# EasyEDA Pro project HammerHacks II Badge PCB.eprj

# Schematic HammerHacks II Badge PCB
Board Name: HammerHacks II Badge PCB; Create Date: 2026-04-06; Page Name: HammerHacks II Badge PCB; Project Name: HammerHacks II Badge PCB; Schematic Name: HammerHacks II Badge PCB; Update Date: 2026-04-06; File: HammerHacks II Badge PCB; Id: /; Sheet: /
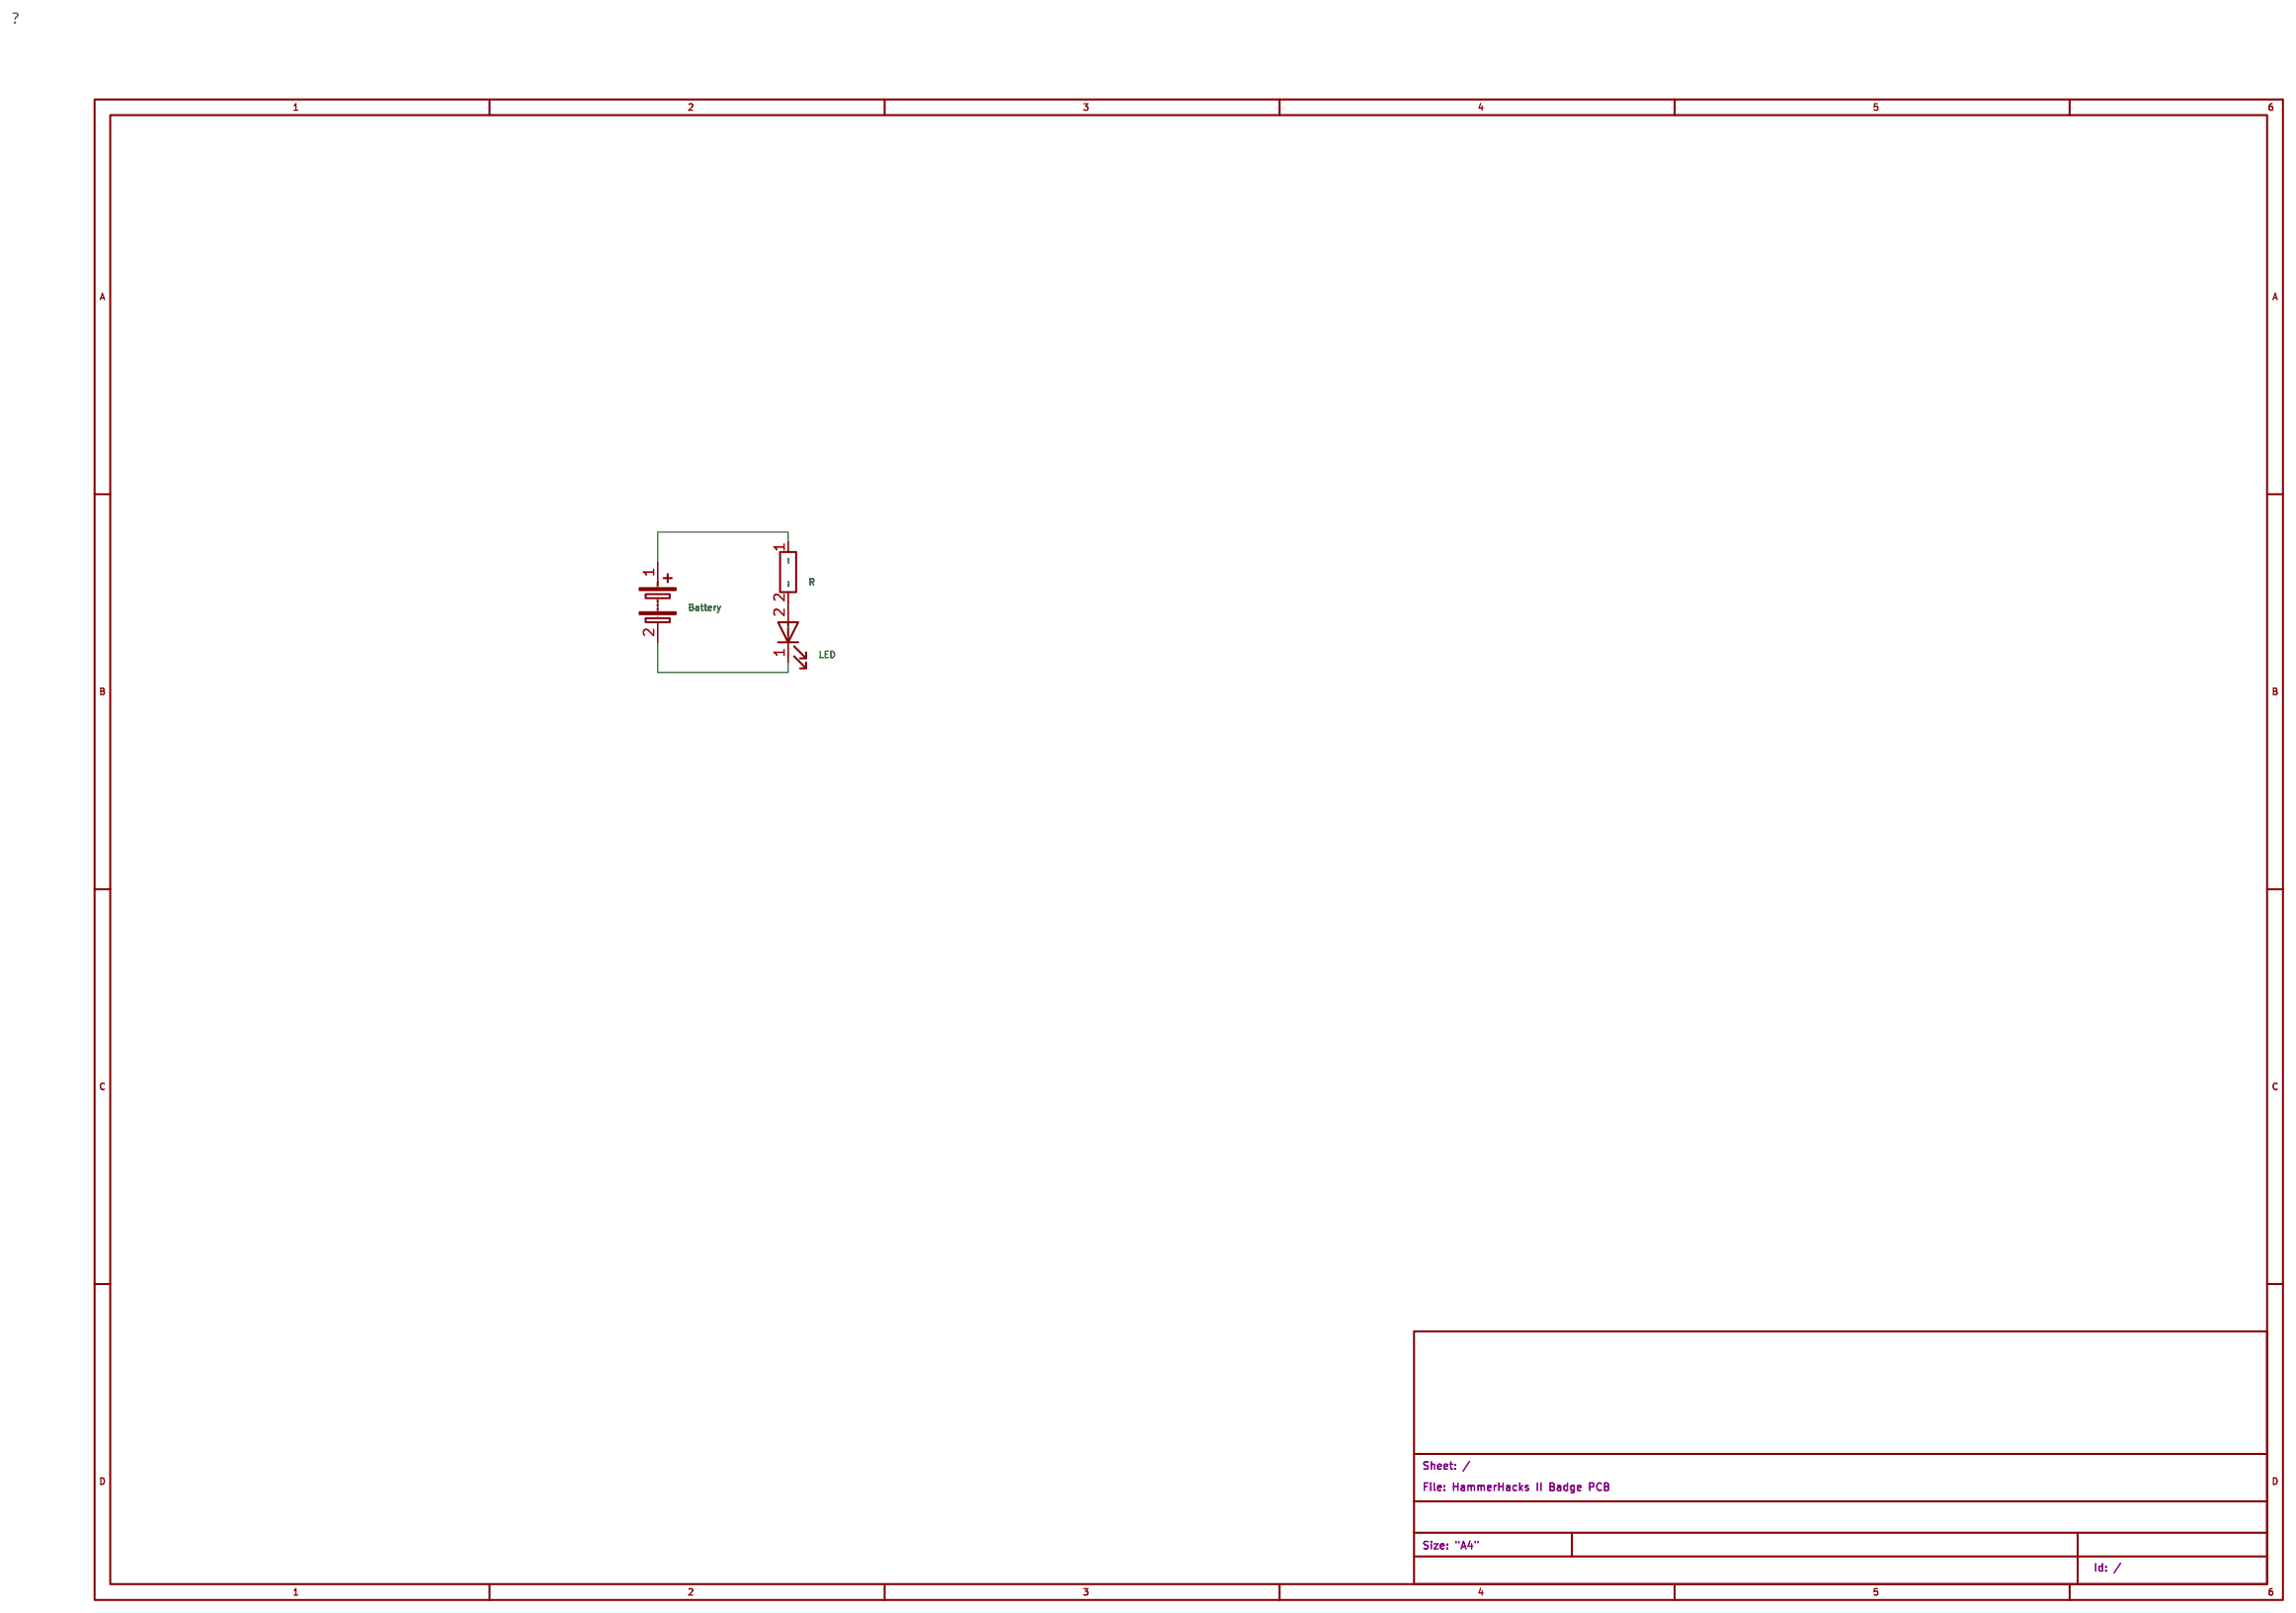
[diagram p0: schematic sheet]

## Parts
BT1  Battery  [Battery:BatteryHolder_Keystone_3034_1x20mm]
D1  LED  [LED_THT:LED_D3.0mm]
R1  R  [RES-TH_BD2.3-L6.3-P10.3-D0.6]

## Library data of the parts
BT1 = Device_Battery: Multiple-cell battery
D1 = Device_LED: Light emitting diode; Sim_Pins: 1=K 2=A; Sim.Pins: 1=K 2=A
R1 = Device_R: Resistor

## Nets
$1N1: BT1.2(-) D1.1(K)
$1N2: BT1.1(+) R1.1
$1N54: D1.2(A) R1.2

# Board OLD
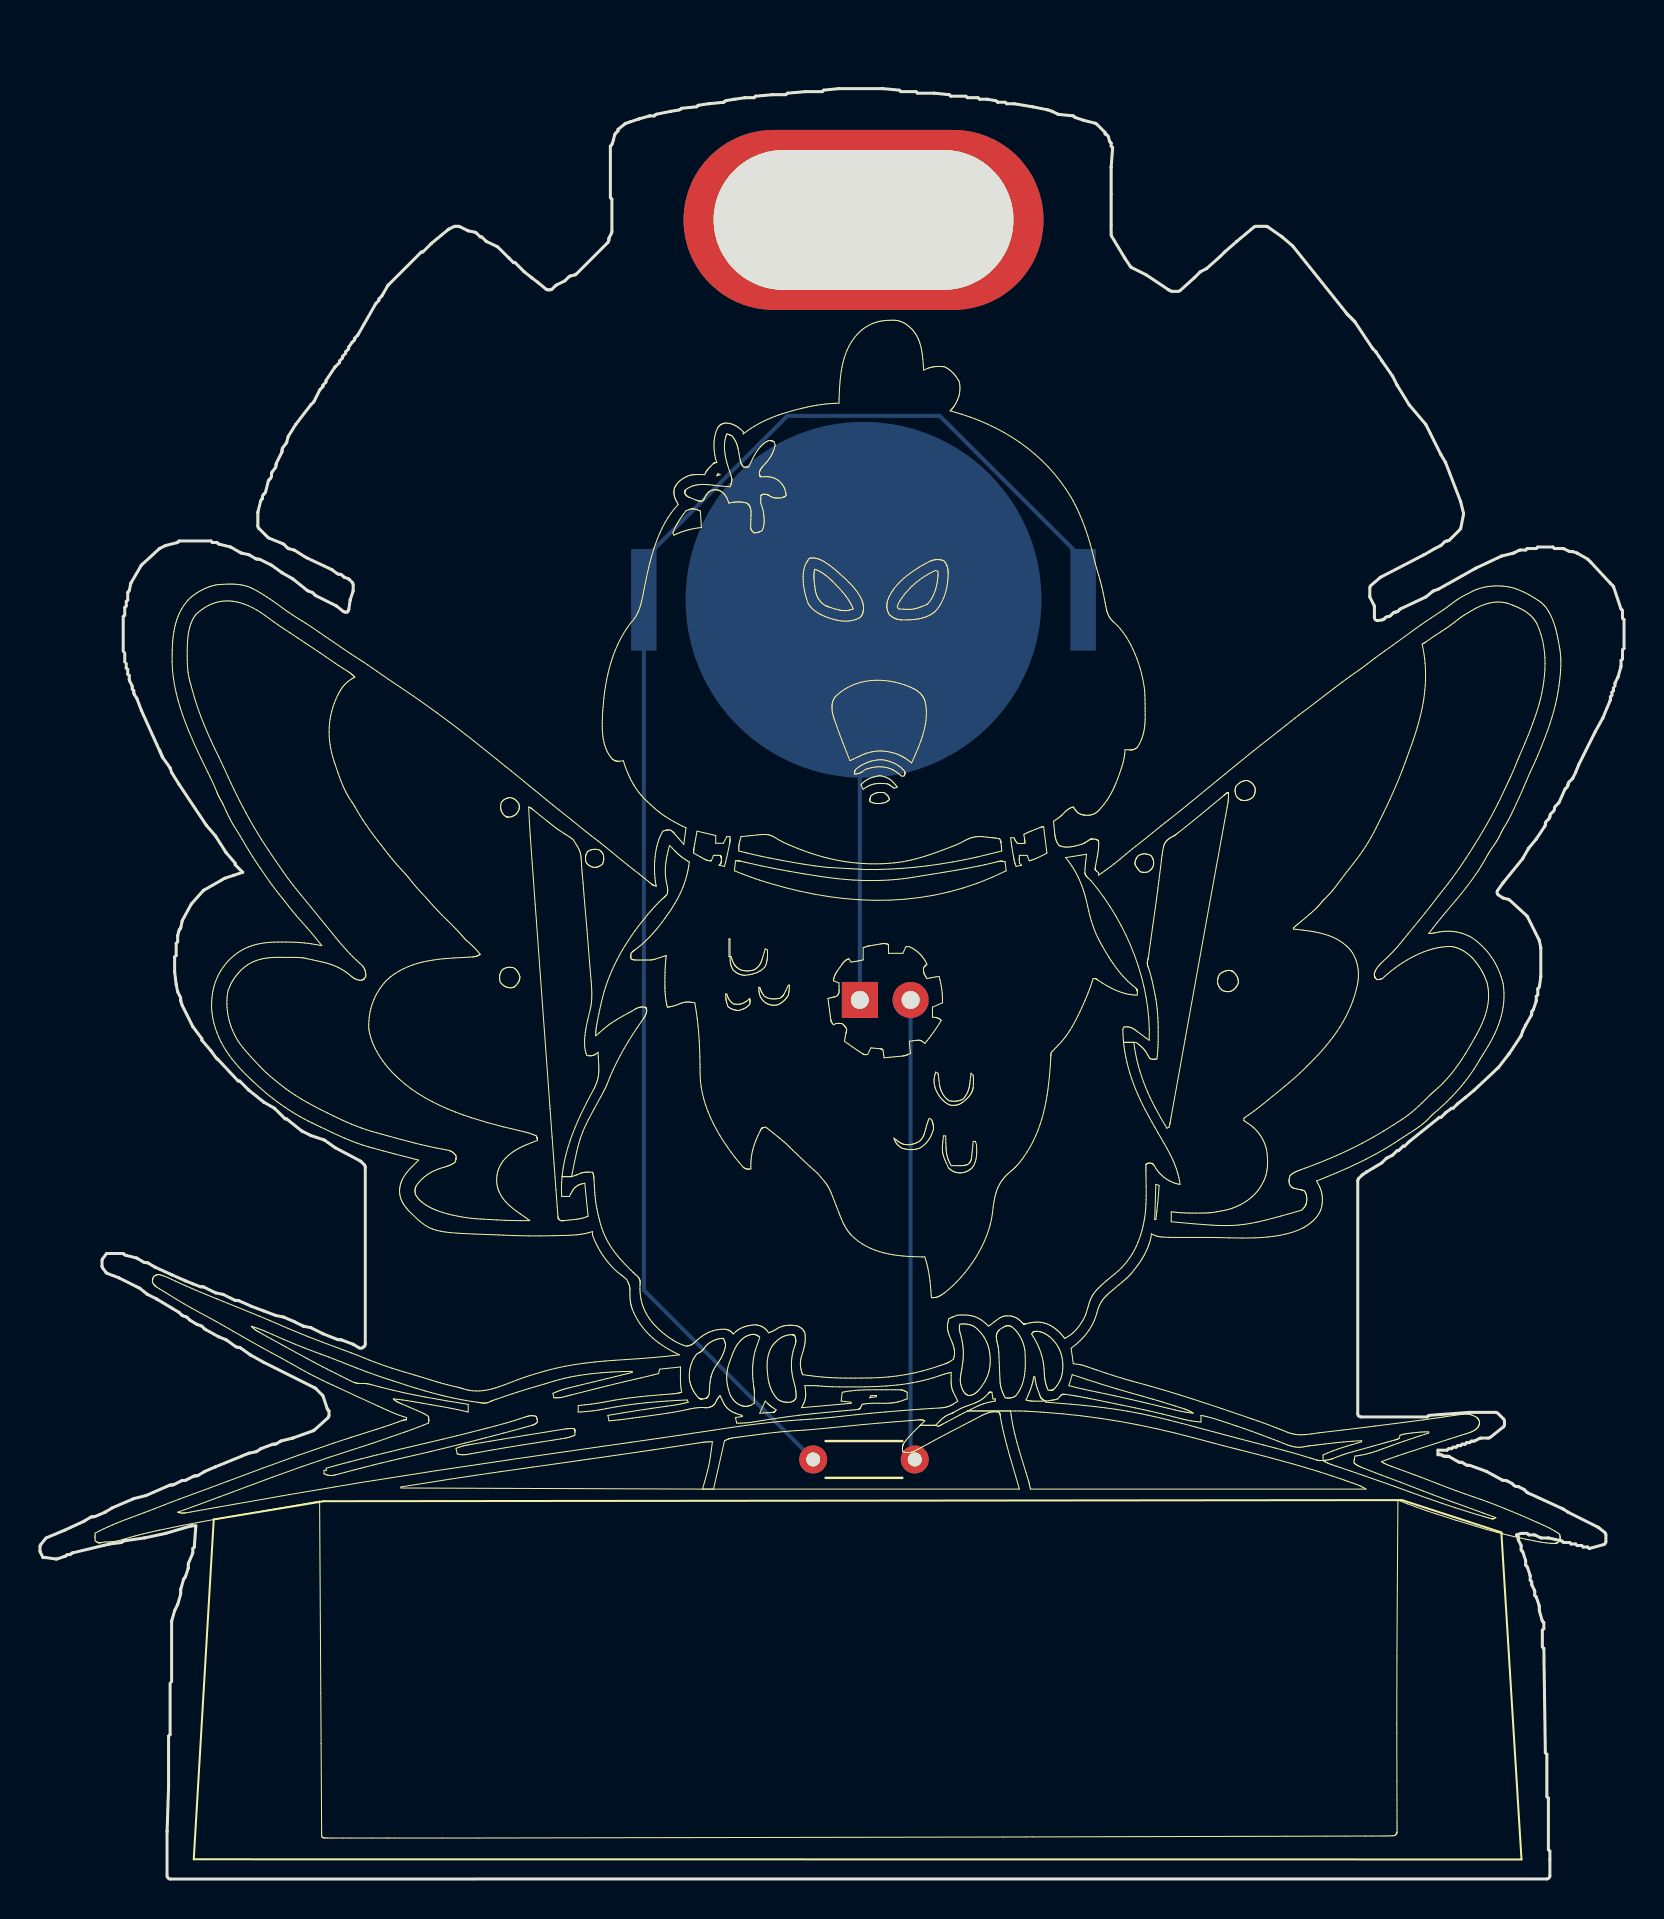
[diagram p1: board, top side]
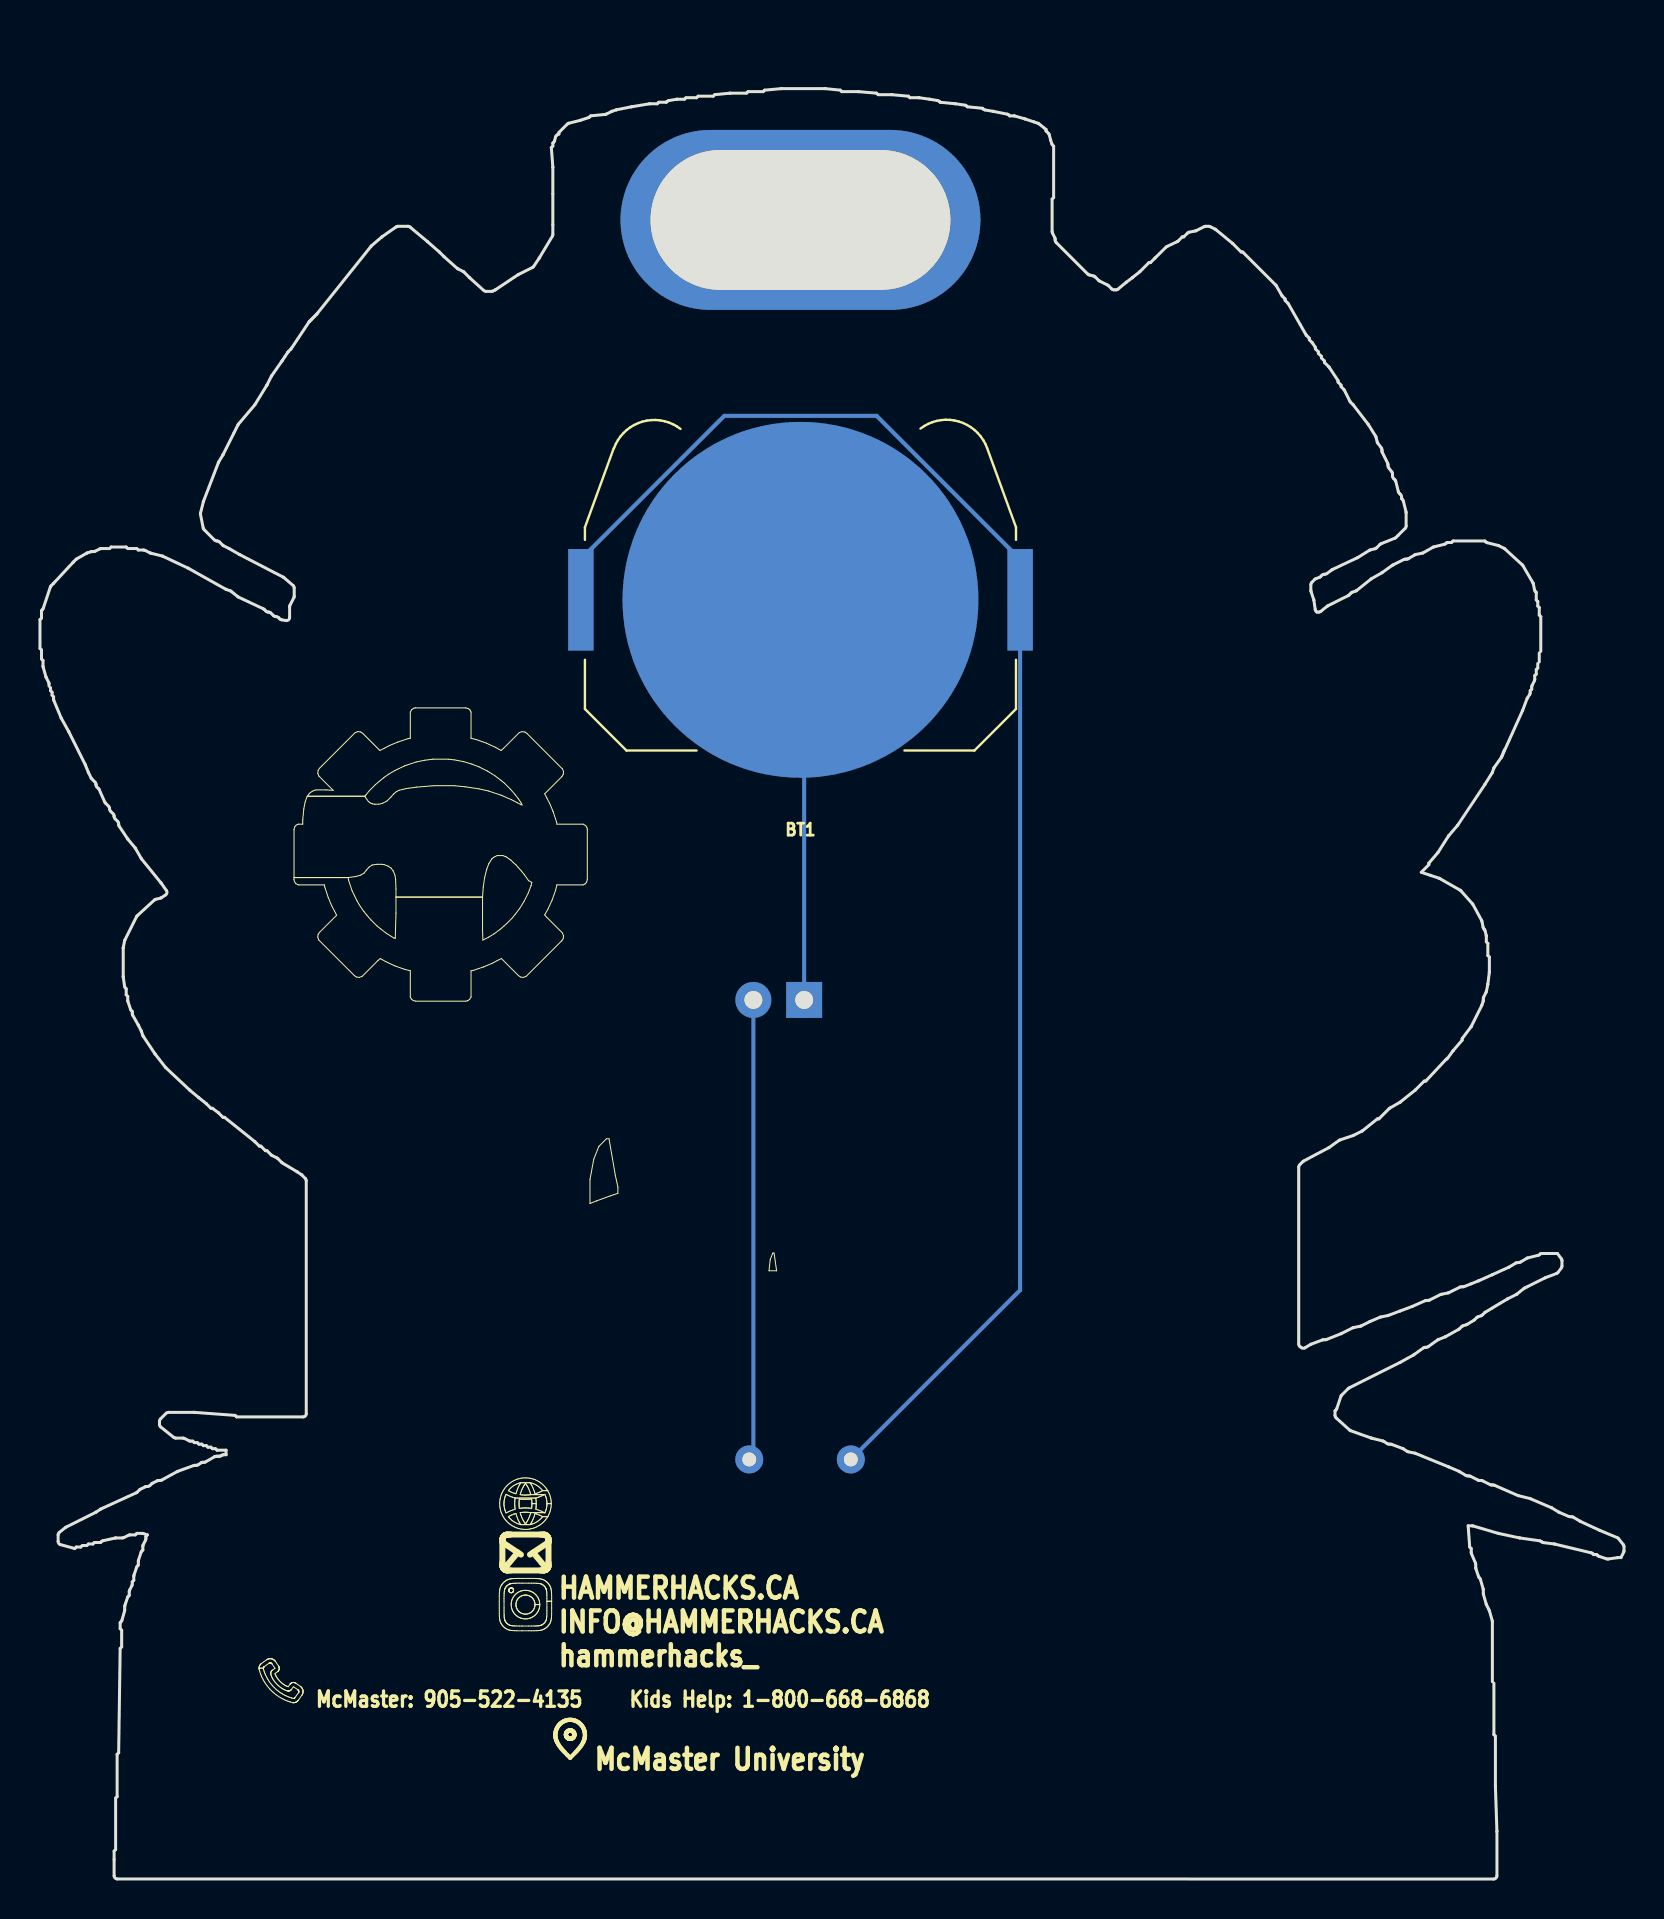
[diagram p2: board, bottom side, seen from below]

Outline 79.23 x 89.55 mm; copper layers: Top Layer, Bottom Layer. Coordinates in mm from the lower left corner of the outline.
Stack: Top Layer 0.035mm / Dielectric1 1.51mm FR4 er 4.5 / Bottom Layer 0.035mm

## Design rules (mm)
spacing safeClearance (default): track to track 0, other pairs 0 to 0.5
track width trackWidth (default): min 0.127, default 0.254, max 2.54
differential pair differentialPair (default): width min 0.127, default 0.254, max 2.54; gap min 0.152, default 0.152
via viaSize (default): diameter min 0.5, default 0.61, max 10; hole min 0.3, default 0.305, max 6

## Placement (name value [footprint] x y rotation side)
BT1  Battery  [Battery:BatteryHolder_Keystone_3034_1x20mm]  41.19 63.98 0 bottom
D1  LED  [LED_THT:LED_D3.0mm]  41.01 43.97 0 top
R1  -  [Resistor_THT:R_Axial_DIN0204_L3.6mm_D1.6mm_P5.08mm_Horizontal]  38.67 20.99 0 top
REF**  Lan Hole  [hole:Lan Hole]  46.19 81.49 0 top

## Footprints (pads in the part's own frame, mm; a bottom-side part is the same pattern mirrored in y, then rotated)
Battery:BatteryHolder_Keystone_3034_1x20mm
  rect 1.27x5.08 smd: 1(-10.985,0) 1(10.985,0)
  round 17.8 smd: 2(0,0)
hole:Lan Hole
  oval 18x9 hole 15x7: (-5,1.5)
LED_THT:LED_D3.0mm
  rect 1.8x1.8 hole 0.9: 1(0,0)
  round 1.8 hole 0.9: 2(2.54,0)
Resistor_THT:R_Axial_DIN0204_L3.6mm_D1.6mm_P5.08mm_Horizontal
  round 1.4 hole 0.7: 1(0,0) 2(5.08,0)

## Nets
NET-(BT1-+): BT1.1 R1.1
NET-(BT1--): BT1.2 D1.1
NET-(D1-A): D1.2 R1.2

## Routing (per net, layer and track width the routed paths; a pad name or vN(x,y) marks a point on that pad's centre or on a via; arc(x,y) is an arc through that point)
NET-(BT1-+): length 78.5
  Bottom Layer w0.2: BT1.1 52.18,66.01 45,73.19 37.38,73.19 30.21,66.01 BT1.1 30.21,29.45 R1.1
NET-(BT1--): length 20.1
  Bottom Layer w0.2: BT1.2 41.01,63.8 D1.1 ; 41.19,43.99 41.22,43.97
NET-(D1-A): length 23.1
  Bottom Layer w0.2: R1.2 43.55,21.19 D1.2 ; 43.75,43.97 43.76,43.97

## Text on the board
Bottom Silkscreen Layer: McMaster: 905-522-4135	Kids Help: 1-800-668-6868 | McMaster University | HAMMERHACKS.CA / INFO@HAMMERHACKS.CA / hammerhacks_

# Board HammerHacks II Badge PCB_1
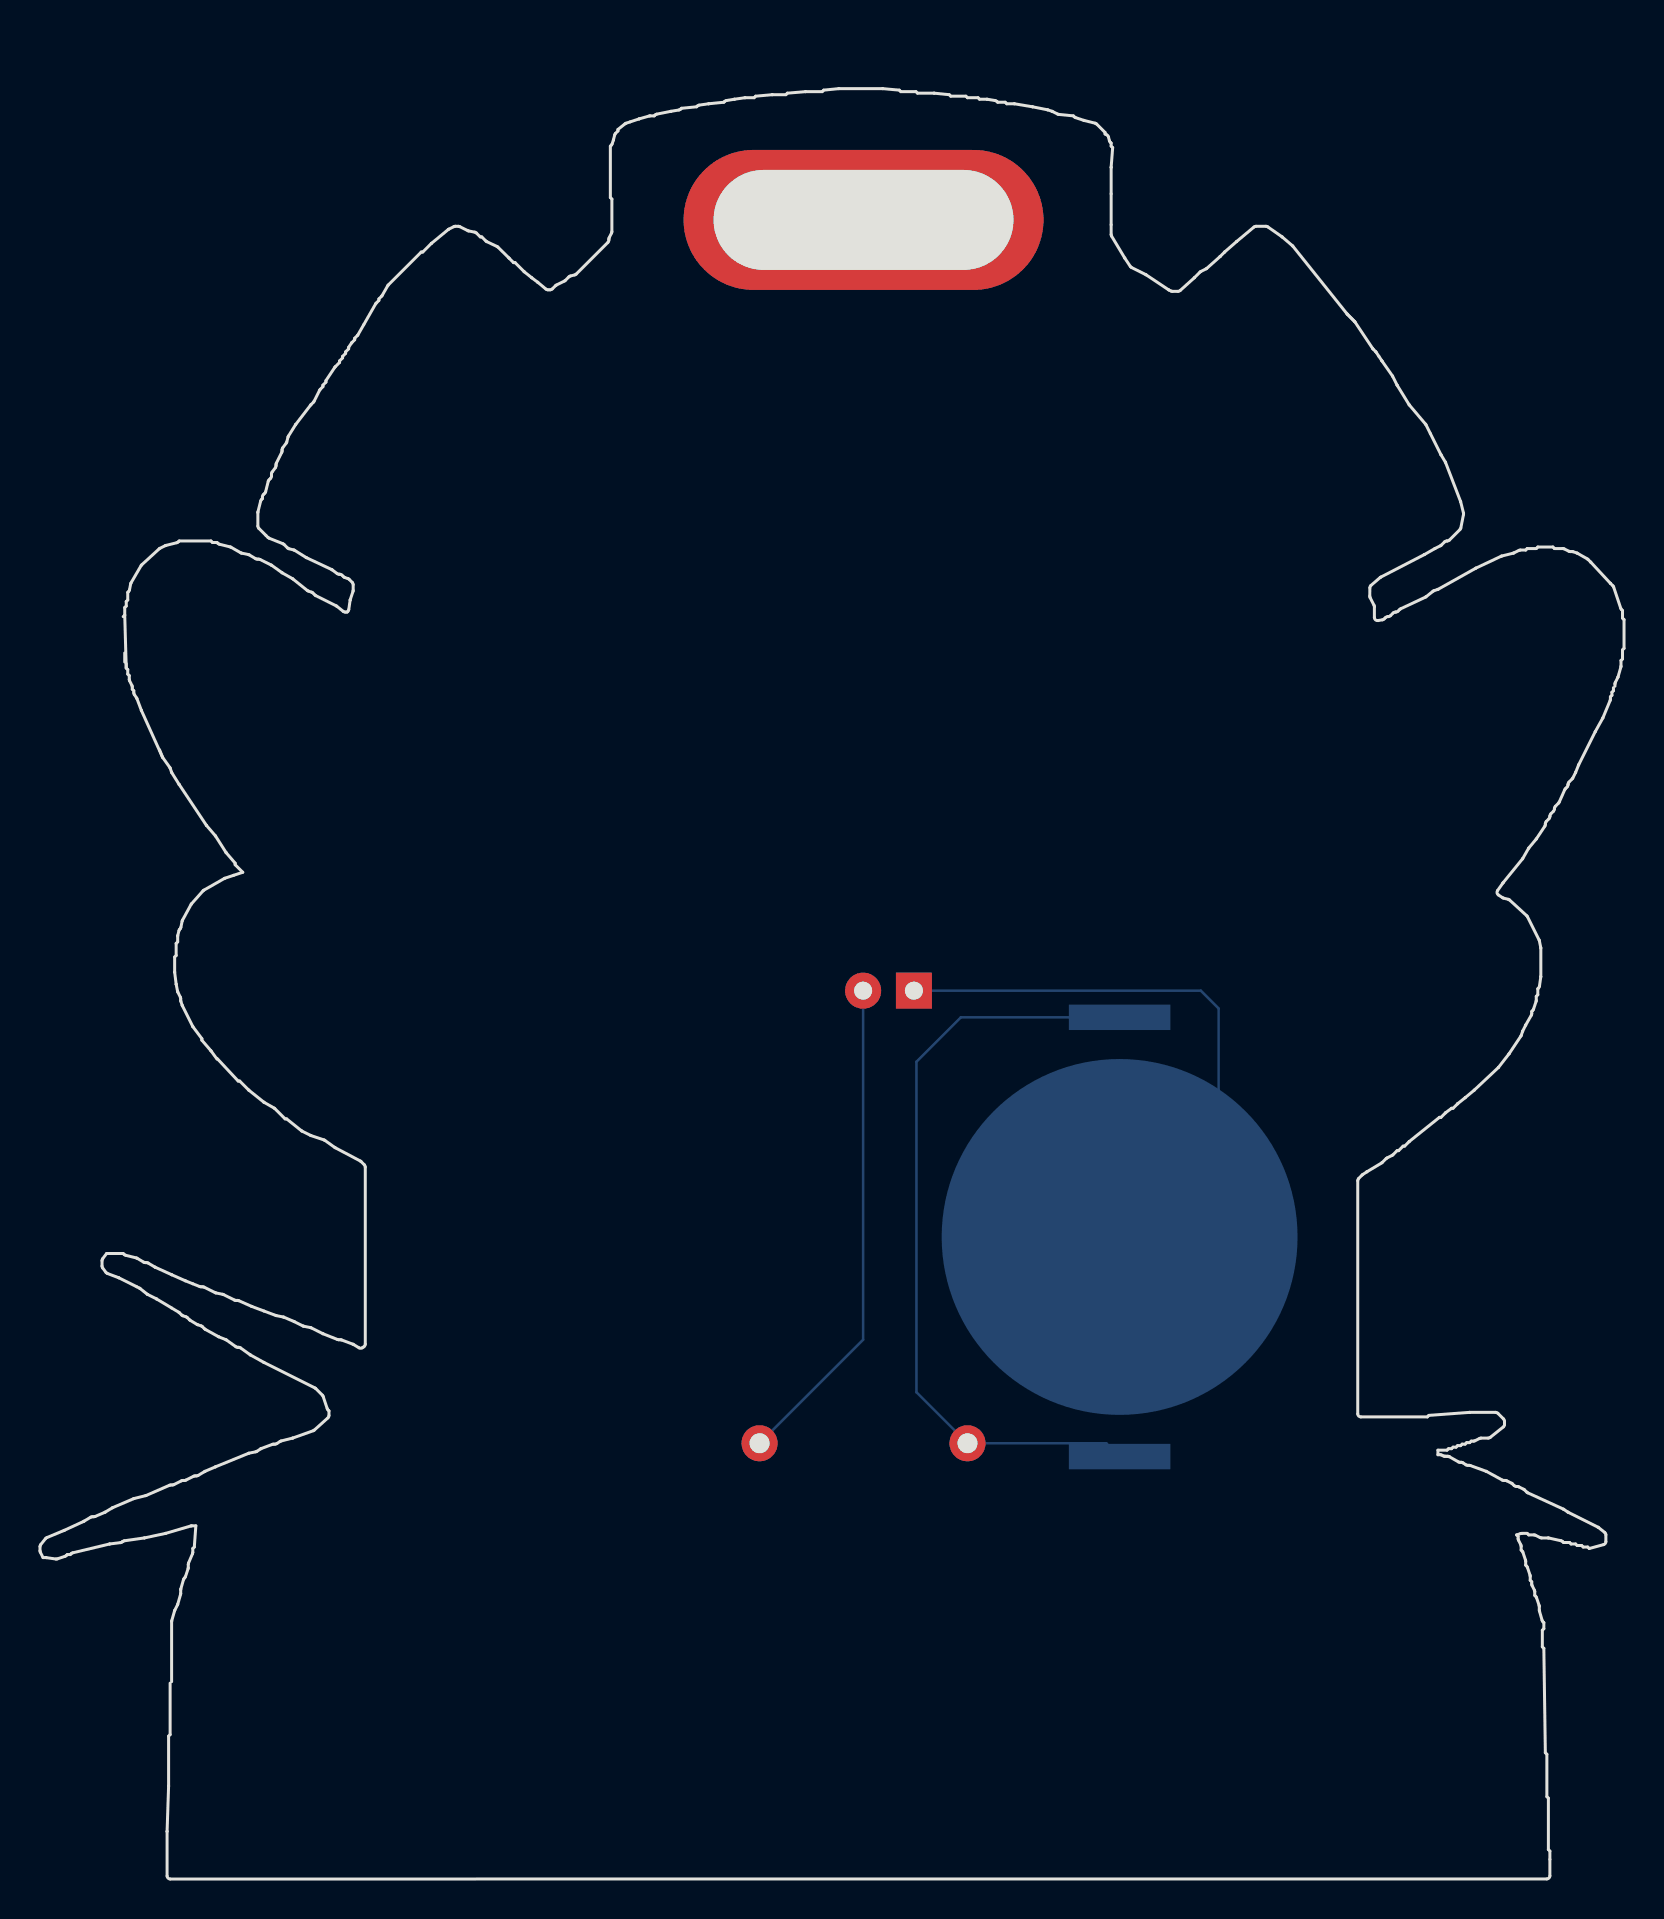
[diagram p3: board, top side]
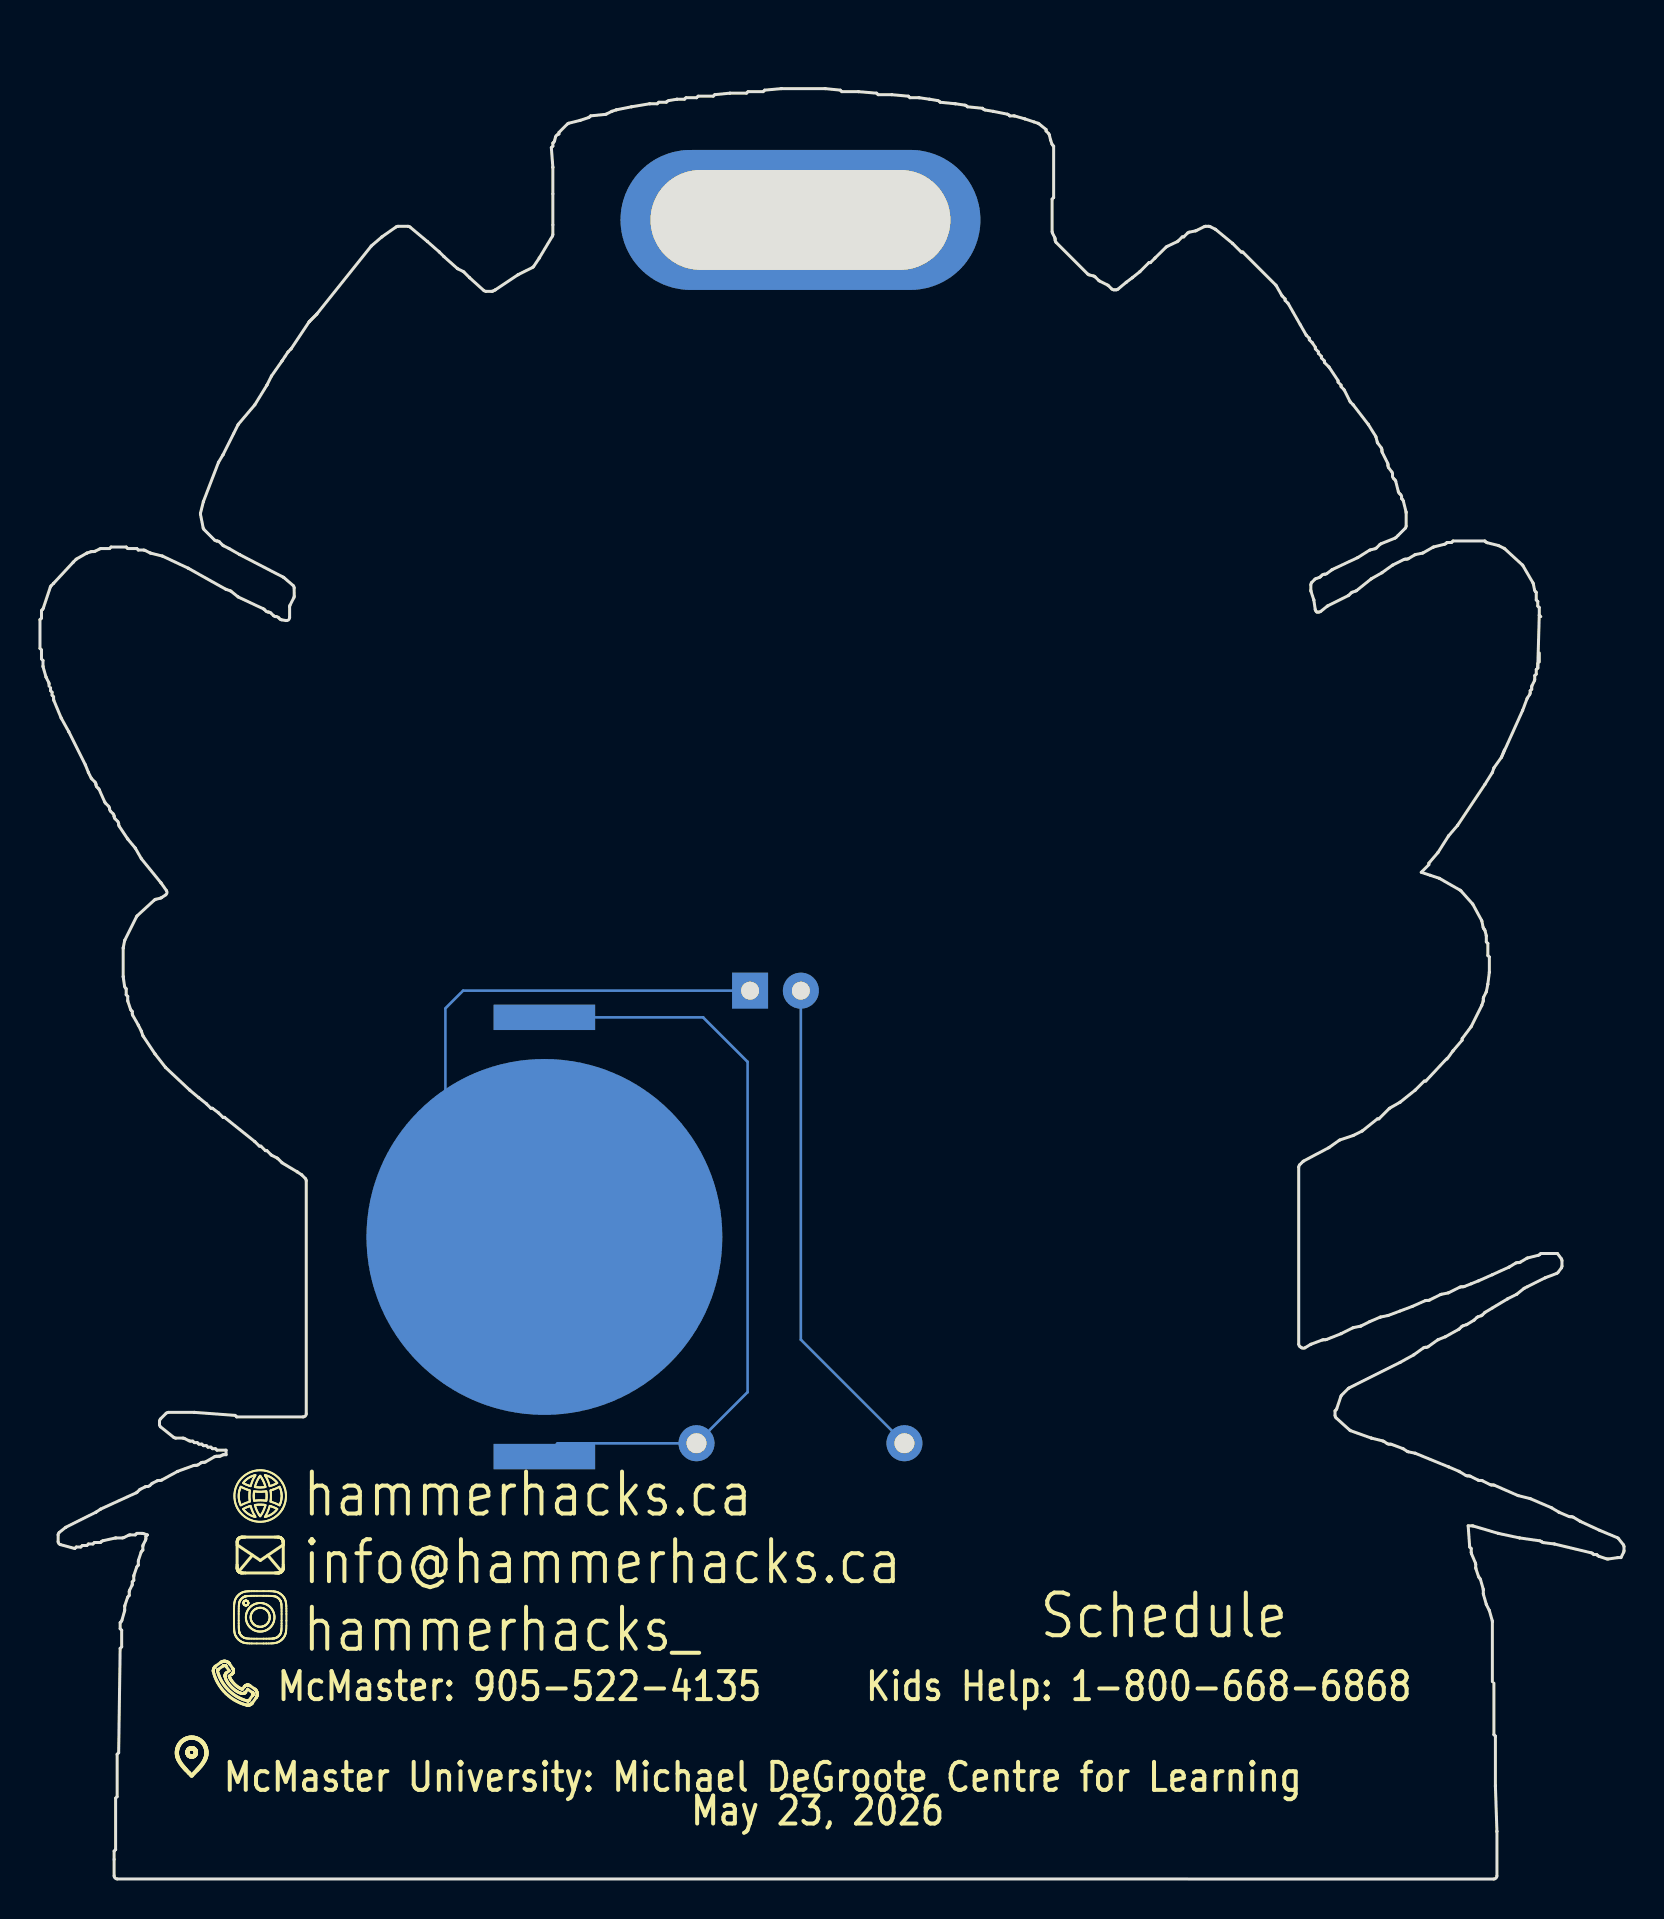
[diagram p4: board, bottom side, seen from below]

Outline 79.23 x 89.55 mm; copper layers: Top Layer, Bottom Layer. Coordinates in mm from the lower left corner of the outline.
Stack: Top Layer 0.035mm / Dielectric1 1.51mm FR4 er 4.5 / Bottom Layer 0.035mm

## Design rules (mm)
spacing safeClearance (default): track to track 0, other pairs 0 to 0.5
track width trackWidth (default): min 0.127, default 0.254, max 2.54
differential pair differentialPair (default): width min 0.127, default 0.254, max 2.54; gap min 0.152, default 0.152
via viaSize (default): diameter min 0.5, default 0.61, max 10; hole min 0.3, default 0.305, max 6

## Placement (name value [footprint] x y rotation side)
BT1  Battery  [Battery:BatteryHolder_Keystone_3034_1x20mm]  54 32.12 270 bottom
D1  LED  [LED_THT:LED_D3.0mm]  43.71 44.43 180 top
R1  R  [RES-TH_BD2.3-L6.3-P10.3-D0.6]  41.19 21.8 180 bottom
REF**  Lan Hole  [hole:Lan Hole]  46.19 81.49 0 top

## Footprints (pads in the part's own frame, mm; a bottom-side part is the same pattern mirrored in y, then rotated)
Battery:BatteryHolder_Keystone_3034_1x20mm
  rect 1.27x5.08 smd: 1(-10.985,0) 1(10.985,0)
  round 17.8 smd: 2(0,0)
hole:Lan Hole
  oval 18x7 hole 15x5: (-5,1.5)
LED_THT:LED_D3.0mm
  rect 1.8x1.8 hole 0.9: 1(0,0)
  round 1.8 hole 0.9: 2(2.54,0)
RES-TH_BD2.3-L6.3-P10.3-D0.6
  round 1.8 hole 1: 1(-5.2,0) 2(5.2,0)

## Nets
As in the schematic.

## Routing (per net, layer and track width the routed paths; a pad name or vN(x,y) marks a point on that pad's centre or on a via; arc(x,y) is an arc through that point)
$1N1: length 29.1
  Bottom Layer w0.127: BT1.2 58.95,37.07 58.95,43.55 58.06,44.43 D1.1
$1N2: length 39.1
  Bottom Layer w0.127: BT1.1 53.33,21.8 R1.1 43.84,24.35 43.84,40.88 46.06,43.1 BT1.1
$1N54: length 24.8
  Bottom Layer w0.127: R1.2 41.17,26.98 D1.2

## Text on the board
Bottom Silkscreen Layer: May 23, 2026 | McMaster: 905-522-4135	 Kids Help: 1-800-668-6868 | McMaster University: Michael DeGroote Centre for Learning | hammerhacks.ca / info@hammerhacks.ca / hammerhacks_ | Schedule
